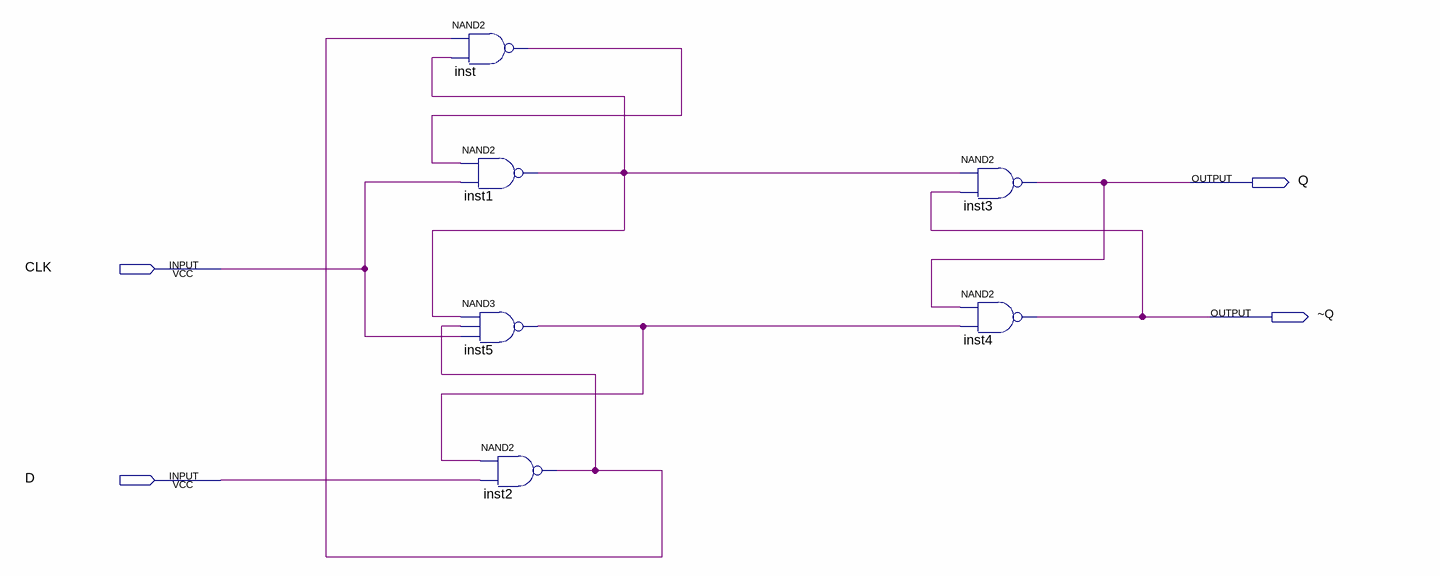
[diagram p0: schematic sheet]
// Quartus schematic Labstep3b.bdf as structural Verilog: 6 symbols, 4 pins
module Labstep3b (
  input  CLK,
  input  D,
  output Q,
  output \~Q 
);

  wire inst1_out, inst2_out, inst5_out, inst_out;

  nand inst (inst_out, inst2_out, inst1_out);
  nand inst1 (inst1_out, inst_out, CLK);
  nand inst5 (inst5_out, inst1_out, inst2_out, CLK);
  nand inst2 (inst2_out, inst5_out, D);
  nand inst3 (Q, inst1_out, \~Q );
  nand inst4 (\~Q , Q, inst5_out);
endmodule
